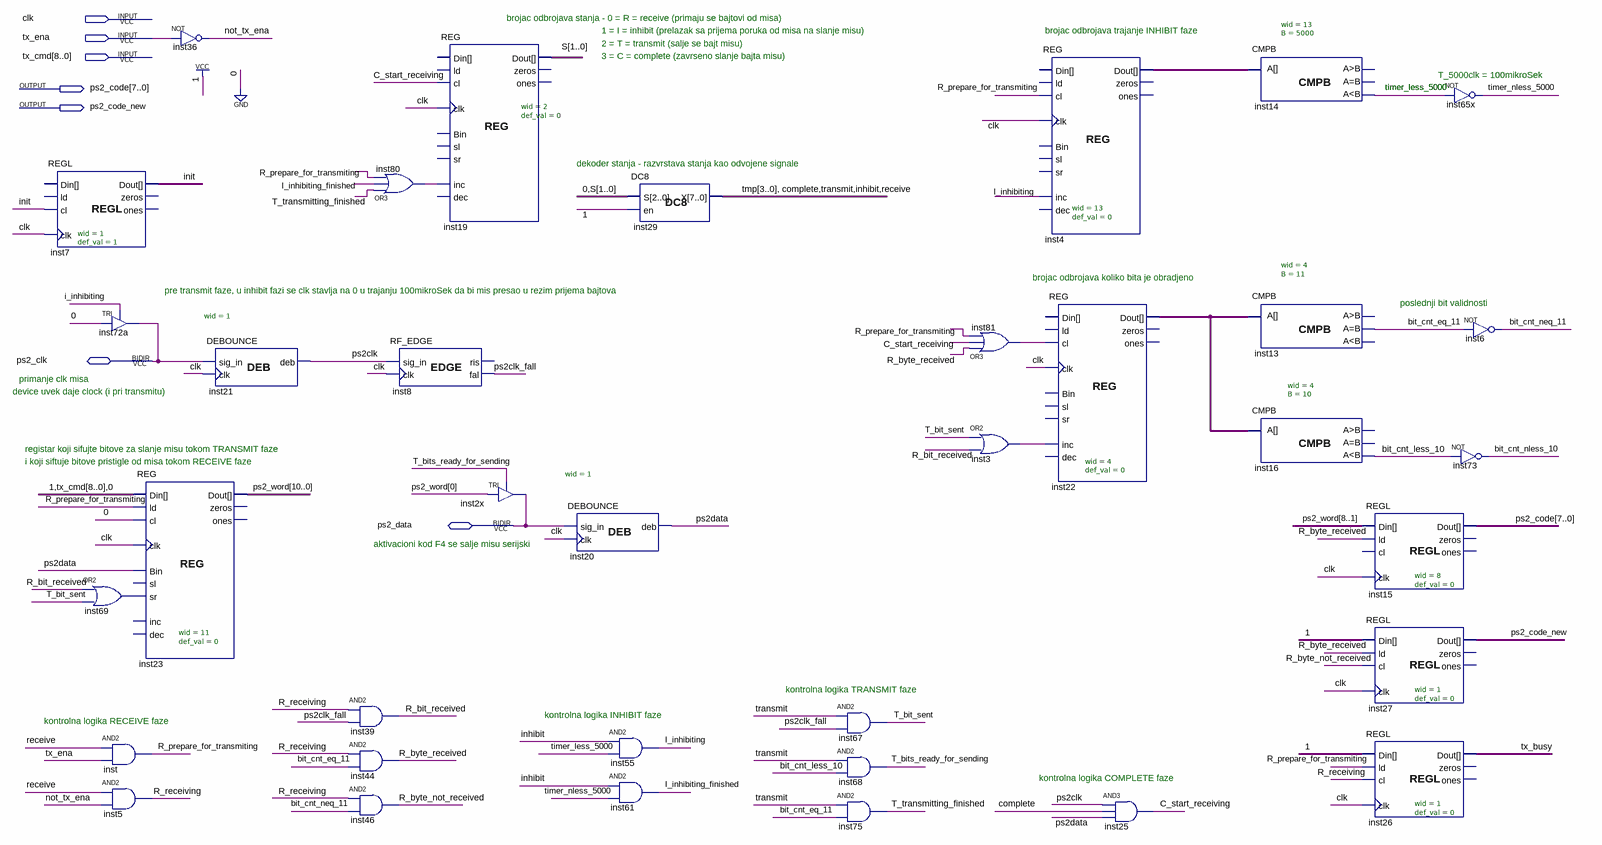
[diagram p0: schematic sheet]
// Quartus schematic transiver.bdf as structural Verilog: 36 symbols, 7 pins
module transiver (
  input  clk,
  input  tx_ena,
  input  [8:0] tx_cmd,
  inout  ps2_clk,
  inout  ps2_data,
  output [7:0] ps2_code,
  output ps2_code_new
);

  wire bit_cnt_eq_11, bit_cnt_less_10, bit_cnt_neq_11, bit_cnt_nless_10, C_start_receiving, complete,
       I_inhibiting, I_inhibiting_finished, inhibit, init, inst3_out, inst69_out, inst80_out, inst81_out,
       not_tx_ena, ps2clk, ps2clk_fall, ps2data, R_bit_received, R_byte_not_received, R_byte_received,
       R_prepare_for_transmiting, R_receiving, receive, T_bit_sent, T_bits_ready_for_sending,
       T_transmitting_finished, timer_less_5000, timer_nless_5000, transmit, tx_busy;
  wire [1:0] S;
  wire [3:0] inst22_dout, tmp;
  wire [10:0] ps2_word;
  wire [12:0] inst4_dout;

  REGL #(.wid(1), .def_val(1)) inst7 (.cl(init), .clk(clk), .Dout(init));  // open: Din, ld, zeros, ones
  TRI inst72a (.IN(1'b0), .OE(I_inhibiting), .OUT(ps2_clk));
  or inst69 (inst69_out, R_bit_received, T_bit_sent);
  and inst (R_prepare_for_transmiting, receive, tx_ena);
  and inst5 (R_receiving, receive, not_tx_ena);
  REG #(.wid(11), .def_val(0)) inst23 (
    .ld(R_prepare_for_transmiting), .cl(1'b0), .clk(clk), .Bin(ps2data), .sr(inst69_out),
    .Din({1'b1, tx_cmd, 1'b0}), .Dout(ps2_word));  // open: sl, inc, dec, zeros, ones
  not inst36 (not_tx_ena, tx_ena);
  DEBOUNCE #(.wid(1)) inst21 (.sig_in(ps2_clk), .clk(clk), .deb(ps2clk));
  and inst39 (R_bit_received, R_receiving, ps2clk_fall);
  and inst44 (R_byte_received, R_receiving, bit_cnt_eq_11);
  and inst46 (R_byte_not_received, R_receiving, bit_cnt_neq_11);
  or inst80 (inst80_out, T_transmitting_finished, I_inhibiting_finished, R_prepare_for_transmiting);
  RF_EDGE inst8 (.sig_in(ps2clk), .clk(clk), .fal(ps2clk_fall));  // open: ris
  REG #(.wid(2), .def_val(0)) inst19 (
    .cl(C_start_receiving), .clk(clk), .inc(inst80_out), .Dout(S));  // open: ld, Bin, sl, sr, dec, Din, zeros, ones
  TRI inst2x (.IN(ps2_word[0]), .OE(T_bits_ready_for_sending), .OUT(ps2_data));
  DEBOUNCE #(.wid(1)) inst20 (.sig_in(ps2_data), .clk(clk), .deb(ps2data));
  and inst55 (I_inhibiting, inhibit, timer_less_5000);
  and inst61 (I_inhibiting_finished, inhibit, timer_nless_5000);
  DC8 inst29 (.S({1'b0, S}), .en(1'b1), .X({tmp, complete, transmit, inhibit, receive}));
  and inst67 (T_bit_sent, transmit, ps2clk_fall);
  and inst68 (T_bits_ready_for_sending, transmit, bit_cnt_less_10);
  and inst75 (T_transmitting_finished, transmit, bit_cnt_eq_11);
  or inst81 (inst81_out, R_byte_received, C_start_receiving, R_prepare_for_transmiting);
  or inst3 (inst3_out, T_bit_sent, R_bit_received);
  REG #(.wid(13), .def_val(0)) inst4 (
    .cl(R_prepare_for_transmiting), .clk(clk), .inc(I_inhibiting), .Dout(inst4_dout));  // open: ld, Bin, sl, sr, dec, Din, zeros, ones
  REG #(.wid(4), .def_val(0)) inst22 (
    .cl(inst81_out), .clk(clk), .inc(inst3_out), .Dout(inst22_dout));  // open: ld, Bin, sl, sr, dec, Din, zeros, ones
  and inst25 (C_start_receiving, ps2clk, complete, ps2data);
  CMPB #(.wid(13), .B(5000)) inst14 (.A(inst4_dout), .ls(timer_less_5000));  // open: gr, eq
  CMPB #(.wid(4), .B(11)) inst13 (.A(inst22_dout), .eq(bit_cnt_eq_11));  // open: gr, ls
  CMPB #(.wid(4), .B(10)) inst16 (.A(inst22_dout), .ls(bit_cnt_less_10));  // open: gr, eq
  REGL #(.wid(8), .def_val(0)) inst15 (
    .Din(ps2_word[8:1]), .ld(R_byte_received), .clk(clk), .Dout(ps2_code));  // open: cl, zeros, ones
  REGL #(.wid(1), .def_val(0)) inst27 (
    .Din(1'b1), .ld(R_byte_received), .cl(R_byte_not_received), .clk(clk), .Dout(ps2_code_new));  // open: zeros, ones
  REGL #(.wid(1), .def_val(0)) inst26 (
    .Din(1'b1), .ld(R_prepare_for_transmiting), .cl(R_receiving), .clk(clk), .Dout(tx_busy));  // open: zeros, ones
  not inst65x (timer_nless_5000, timer_less_5000);
  not inst6 (bit_cnt_neq_11, bit_cnt_eq_11);
  not inst73 (bit_cnt_nless_10, bit_cnt_less_10);

  // Notes on the sheet:
  //   brojac odbrojava stanja - 0 = R = receive (primaju se bajtovi od misa)
  //   1 = I = inhibit (prelazak sa prijema poruka od misa na slanje misu)
  //   brojac odbrojava trajanje INHIBIT faze
  //   2 = T = transmit (salje se bajt misu)
  //   3 = C = complete (zavrseno slanje bajta misu)
  //   T_5000clk = 100mikroSek
  //   timer_less_5000
  //   dekoder stanja - razvrstava stanja kao odvojene signale
  //   brojac odbrojava koliko bita je obradjeno
  //   pre transmit faze, u inhibit fazi se clk stavlja na 0 u trajanju 100mikroSek da bi mis presao u rezim prijema bajtova
  //   poslednji bit validnosti
  //   primanje clk misa          
  //   device uvek daje clock (i pri transmitu)
  //   registar koji sifujte bitove za slanje misu tokom TRANSMIT faze
  //   i koji siftuje bitove pristigle od misa tokom RECEIVE faze
  //   aktivacioni kod F4 se salje misu serijski
  //   kontrolna logika TRANSMIT faze
  //   kontrolna logika INHIBIT faze
  //   kontrolna logika RECEIVE faze
  //   kontrolna logika COMPLETE faze
endmodule
